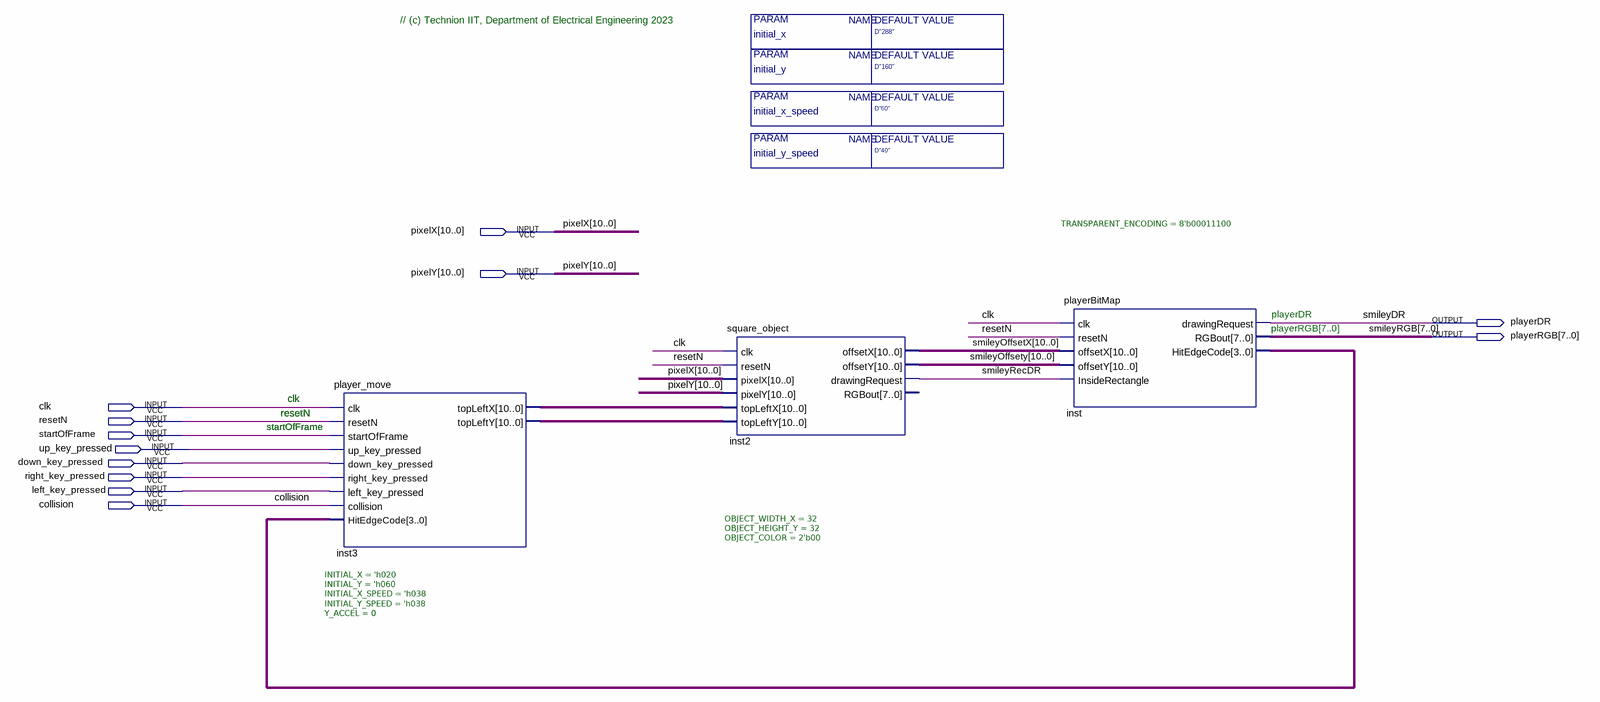
[diagram p0: schematic sheet]
// Quartus schematic Player.bdf as structural Verilog: 3 symbols, 12 pins
module Player #(parameter initial_x_speed = "D\"60\"", parameter initial_y_speed = "D\"40\"", parameter initial_y = "D\"160\"", parameter initial_x = "D\"288\"") (
  input  [10:0] pixelX,
  input  [10:0] pixelY,
  input  clk,
  input  resetN,
  input  startOfFrame,
  input  up_key_pressed,
  input  down_key_pressed,
  input  right_key_pressed,
  input  left_key_pressed,
  input  collision,
  output playerDR,
  output [7:0] playerRGB
);

  wire smileyRecDR;
  wire [3:0] inst_hitedgecode;
  wire [10:0] inst3_topleftx, inst3_toplefty, smileyOffsetX, smileyOffsety;

  player_move #(.INITIAL_X('h020), .INITIAL_Y('h060), .INITIAL_X_SPEED('h038), .INITIAL_Y_SPEED('h038), .Y_ACCEL(0)) inst3 (
    .clk(clk), .resetN(resetN), .startOfFrame(startOfFrame), .up_key_pressed(up_key_pressed),
    .down_key_pressed(down_key_pressed), .right_key_pressed(right_key_pressed),
    .left_key_pressed(left_key_pressed), .collision(collision), .HitEdgeCode(inst_hitedgecode),
    .topLeftX(inst3_topleftx), .topLeftY(inst3_toplefty));
  square_object #(.OBJECT_WIDTH_X(32), .OBJECT_HEIGHT_Y(32), .OBJECT_COLOR(2'b00)) inst2 (
    .clk(clk), .resetN(resetN), .pixelX(pixelX), .pixelY(pixelY), .topLeftX(inst3_topleftx),
    .topLeftY(inst3_toplefty), .offsetX(smileyOffsetX), .offsetY(smileyOffsety), .drawingRequest(smileyRecDR));  // open: RGBout
  playerBitMap #(.TRANSPARENT_ENCODING(8'b00011100)) inst (
    .clk(clk), .resetN(resetN), .offsetX(smileyOffsetX), .offsetY(smileyOffsety),
    .InsideRectangle(smileyRecDR), .drawingRequest(playerDR), .RGBout(playerRGB),
    .HitEdgeCode(inst_hitedgecode));

  // Other names for the same wires on the sheet: smileyDR = playerDR; smileyRGB[7:0] = playerRGB

  // Notes on the sheet:
  //   // (c) Technion IIT, Department of Electrical Engineering 2023
  //   playerDR
  //   playerRGB[7..0]
  //   clk
  //   resetN
  //   startOfFrame
endmodule
